# Altium schematic sheet 03-Block diagram.SchDoc
size A3; SheetNumber: 3; SheetTotal: 3
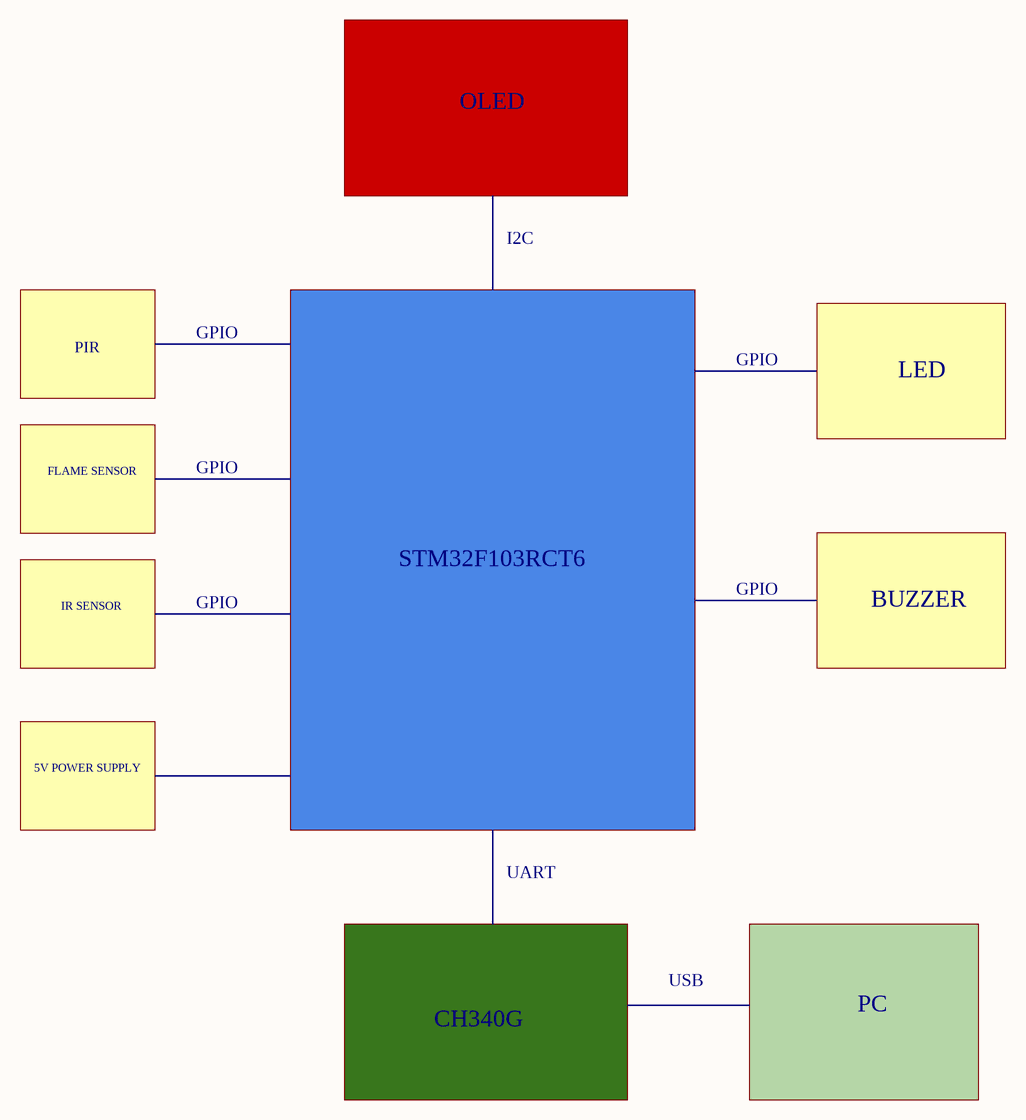
[diagram p0: 03-Block diagram.SchDoc]

## Notes on the sheet
- OLED
- I2C
- PIR
- GPIO
- LED
- FLAME SENSOR
- STM32F103RCT6
- IR SENSOR
- BUZZER
- 5V POWER SUPPLY
- UART
- USB
- CH340G
- PC